# Altium schematic sheet 24V_to_5V.SchDoc
size A4
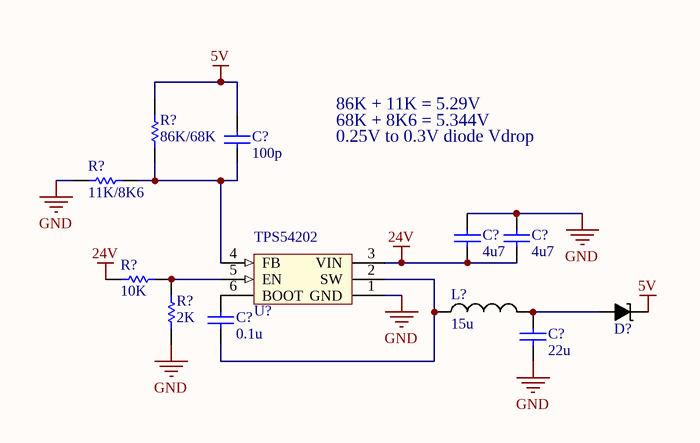
[diagram p0: 24V_to_5V.SchDoc]

## Parts
(Parts that share a designator on the sheet are numbered #1, #2 ... from top to bottom, then left to right.)
C?#1  value 100p  [CAPC1608X90N]  (hidden comment: Cap)
C?#2  value 4u7  [CAPC2012X135N]  (hidden comment: Cap)
C?#3  value 4u7  [CAPC2012X135N]  (hidden comment: Cap)
C?#4  value 0.1u  [CAPC1608X90N]  (hidden comment: Cap)
C?#5  value 22u  [CAPC2012X135N]  (hidden comment: Cap)
D?  SS24  [DO-214AA]  (value not drawn)
L?  value 15u  [INDC_5.5x5.3x3]  (hidden comment: 15uH inductor)
R?#1  value 86K/68K  [RESC1608X55N]  (hidden comment: Res1)
R?#2  value 11K/8K6  [RESC1608X55N]  (hidden comment: Res1)
R?#3  value 10K  [RESC1608X55N]  (hidden comment: Res1)
R?#4  value 2K  [RESC1608X55N]  (hidden comment: Res1)
U?  TPS54202  [SOT23-6]

## Nets
5V: C?#1.2 D?.K(Cathode) R?#1.2
24V: C?#2.2 C?#3.2 R?#3.1 U?.3(VIN)
GND: C?#2.1 C?#3.1 C?#5.1 R?#2.2 R?#4.1 U?.1(GND)
NetC?#1_1: C?#1.1 R?#1.1 R?#2.1 U?.4(FB)
NetC?#4_1: C?#4.1 L?.1 U?.2(SW)
NetC?#4_2: C?#4.2 U?.6(BOOT)
NetC?#5_2: C?#5.2 D?.A(Anode) L?.2
NetR?#3_2: R?#3.2 R?#4.2 U?.5(EN)

## Notes on the sheet
- 86K + 11K = 5.29V
- 68K + 8K6 = 5.344V
- 0.25V to 0.3V diode Vdrop

## Library data of the parts
C?#1-C?#5 = Cap: Capacitor; Published: 8-Jun-2000; LatestRevisionDate: 17-Jul-2002; LatestRevisionNote: Re-released for DXP Platform.; PackageReference: RAD-0.3; Publisher: Altium Limited; PackageDescription: Radial Cap, Thru-Hole; 2 Leads; 0.3 in Pin Spacing
D? = SS24: 2.0A SURFACE MOUNT SCHOTTKY BARRIER RECTIFIER; Voltage: 40V; Current: 2A
L? = INDC_MPX1D0530L150: 15uH inductor with 2A saturation current. Dimension is 5.5 * 5.2 * 3 mm^3; Saturation Current: 2A
R?#1-R?#4 = Res1: Resistor; Published: 8-Jun-2000; LatestRevisionDate: 17-Jul-2002; LatestRevisionNote: Re-released for DXP Platform.; PackageReference: AXIAL-0.3; Publisher: Altium Limited; PackageDescription: Axial Device, Thru-Hole; 2 Leads; 0.3 in Pin Spacing
U? = TPS54202: 4.5-28V input 2A output step down, EMI Friendly Synchronous Step Down Converter; Vin(max): 28V; Vin(min): 4.5V; Currrent: 2A